# Altium project Dual_Power.PrjPcb
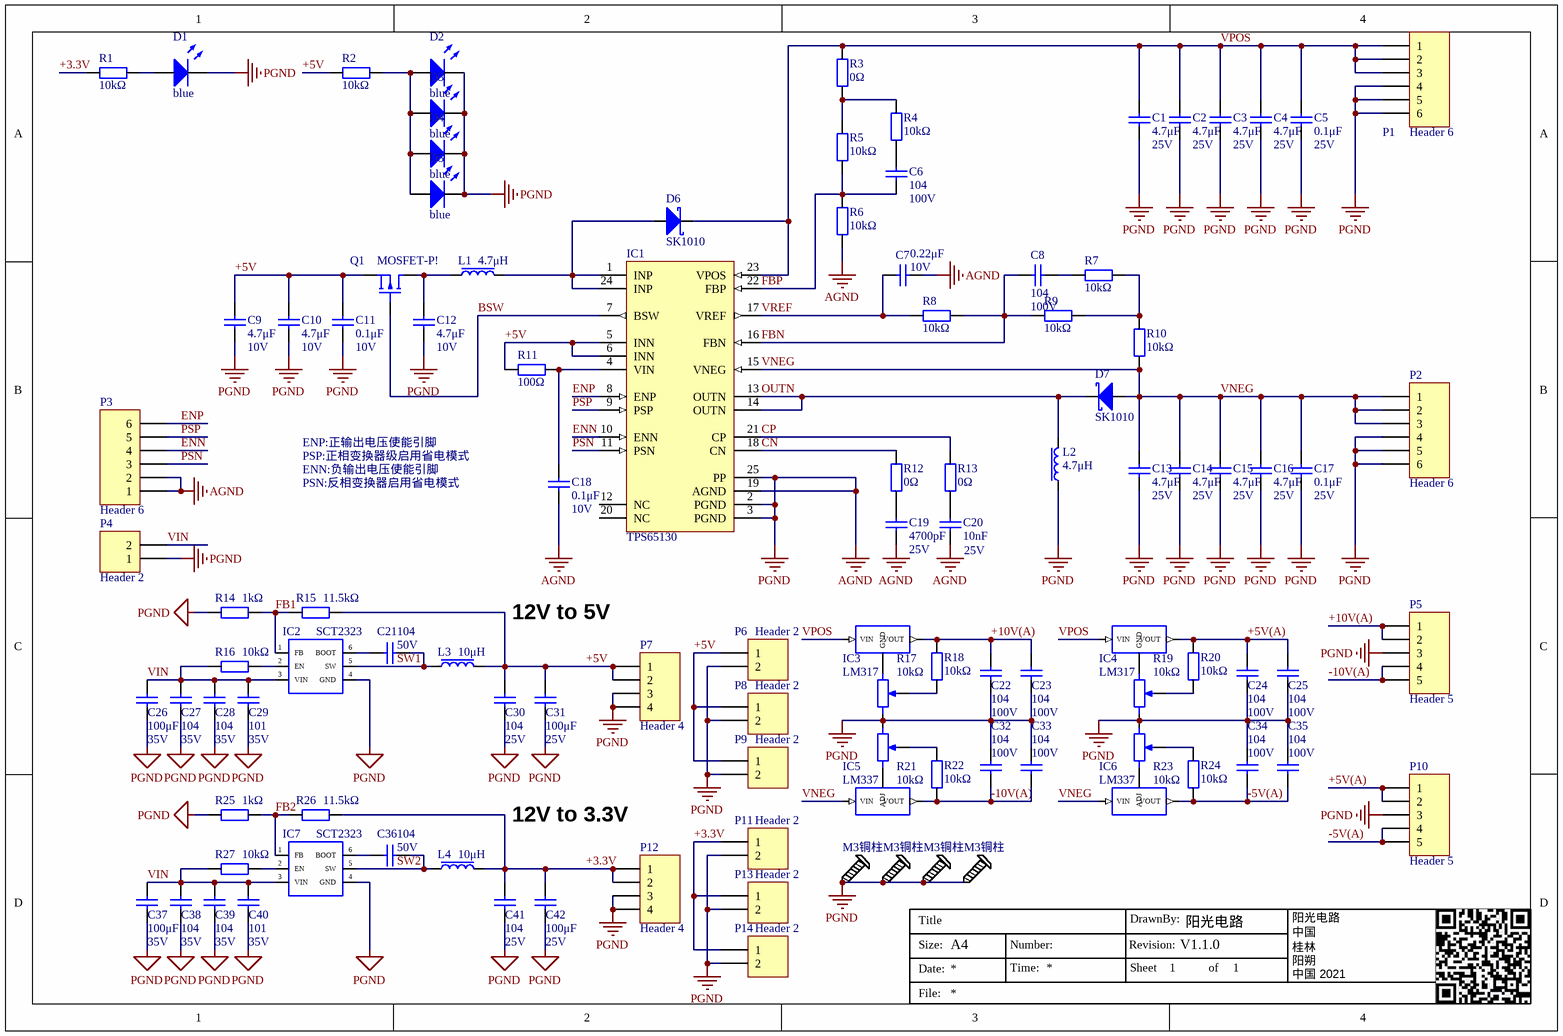
[diagram p0: Dual_Power.SchDoc]
1 sheet, 106 parts. Net scope: global (net labels, ports and power ports of the same name join across sheets).
Board file: Dual_Power.PcbDoc

## Sheet Dual_Power.SchDoc
size A4; DrawnBy: 阳光电路; Organization: 阳光电路; Address1: 中国; Address2: 桂林; Address3: 阳朔; Address4: 中国 2021; Revision: V1.1.0; SheetNumber: 1; SheetTotal: 1

### Parts
C1  capacity: 4.7μF  voltage: 25V  [C0603]  (hidden comment: 叠层陶瓷电容)
C2  capacity: 4.7μF  voltage: 25V  [C0603]  (hidden comment: 叠层陶瓷电容)
C3  capacity: 4.7μF  voltage: 25V  [C0603]  (hidden comment: 叠层陶瓷电容)
C4  capacity: 4.7μF  voltage: 25V  [C0603]  (hidden comment: 叠层陶瓷电容)
C5  capacity: 0.1μF  voltage: 25V  [C0603]  (hidden comment: 叠层陶瓷电容)
C6  voltage: 100V  [C0603]  (hidden comment: 叠层陶瓷电容)
C7  capacity: 0.22μF  voltage: 10V  [C0603]  (hidden comment: 叠层陶瓷电容)
C8  voltage: 100V  [C0603]  (hidden comment: 叠层陶瓷电容)
C9  capacity: 4.7μF  voltage: 10V  [C0603]  (hidden comment: 叠层陶瓷电容)
C10  capacity: 4.7μF  voltage: 10V  [C0603]  (hidden comment: 叠层陶瓷电容)
C11  capacity: 0.1μF  voltage: 10V  [C0603]  (hidden comment: 叠层陶瓷电容)
C12  capacity: 4.7μF  voltage: 10V  [C0603]  (hidden comment: 叠层陶瓷电容)
C13  capacity: 4.7μF  voltage: 25V  [C0603]  (hidden comment: 叠层陶瓷电容)
C14  capacity: 4.7μF  voltage: 25V  [C0603]  (hidden comment: 叠层陶瓷电容)
C15  capacity: 4.7μF  voltage: 25V  [C0603]  (hidden comment: 叠层陶瓷电容)
C16  capacity: 4.7μF  voltage: 25V  [C0603]  (hidden comment: 叠层陶瓷电容)
C17  capacity: 0.1μF  voltage: 25V  [C0603]  (hidden comment: 叠层陶瓷电容)
C18  capacity: 0.1μF  voltage: 10V  [C0603]  (hidden comment: 叠层陶瓷电容)
C19  capacity: 4700pF  voltage: 25V  [C0603]  (hidden comment: 叠层陶瓷电容)
C20  capacity: 10nF  voltage: 25V  [C0603]  (hidden comment: 叠层陶瓷电容)
C21  voltage: 50V  [C0603]  (hidden comment: 叠层陶瓷电容)
C22  voltage: 100V  [C0603]  (hidden comment: 叠层陶瓷电容)
C23  voltage: 100V  [C0603]  (hidden comment: 叠层陶瓷电容)
C24  voltage: 100V  [C0603]  (hidden comment: 叠层陶瓷电容)
C25  voltage: 100V  [C0603]  (hidden comment: 叠层陶瓷电容)
C26  capacity: 100μF  voltage: 35V  [C0603]  (hidden comment: 叠层陶瓷电容)
C27  voltage: 35V  [C0603]  (hidden comment: 叠层陶瓷电容)
C28  voltage: 35V  [C0603]  (hidden comment: 叠层陶瓷电容)
C29  capacity: 101  voltage: 35V  [C0603]  (hidden comment: 叠层陶瓷电容)
C30  voltage: 25V  [C0603]  (hidden comment: 叠层陶瓷电容)
C31  capacity: 100μF  voltage: 25V  [C0603]  (hidden comment: 叠层陶瓷电容)
C32  voltage: 100V  [C0603]  (hidden comment: 叠层陶瓷电容)
C33  voltage: 100V  [C0603]  (hidden comment: 叠层陶瓷电容)
C34  voltage: 100V  [C0603]  (hidden comment: 叠层陶瓷电容)
C35  voltage: 100V  [C0603]  (hidden comment: 叠层陶瓷电容)
C36  voltage: 50V  [C0603]  (hidden comment: 叠层陶瓷电容)
C37  capacity: 100μF  voltage: 35V  [C0603]  (hidden comment: 叠层陶瓷电容)
C38  voltage: 35V  [C0603]  (hidden comment: 叠层陶瓷电容)
C39  voltage: 35V  [C0603]  (hidden comment: 叠层陶瓷电容)
C40  capacity: 101  voltage: 35V  [C0603]  (hidden comment: 叠层陶瓷电容)
C41  voltage: 25V  [C0603]  (hidden comment: 叠层陶瓷电容)
C42  capacity: 100μF  voltage: 25V  [C0603]  (hidden comment: 叠层陶瓷电容)
D1  type: blue  [LED 0603]  (hidden comment: LED)
D2  type: blue  [LED 0603(反贴)]  (hidden comment: LED)
D3  type: blue  [LED 0603(反贴)]  (hidden comment: LED)
D4  type: blue  [LED 0603(反贴)]  (hidden comment: LED)
D5  type: blue  [LED 0603(反贴)]  (hidden comment: LED)
D6  SK1010  [SOD-523]
D7  SK1010  [SOD-523]
IC1  TPS65130  [VQFN-24]
IC2  type: SCT2323  [TSOT-23-6]  (hidden comment: DC-DC)
IC3  LM317  [SOT-223]
IC4  LM317  [SOT-223]
IC5  LM337  [SOT-223]
IC6  LM337  [SOT-223]
IC7  type: SCT2323  [TSOT-23-6]  (hidden comment: DC-DC)
L1  type: 4.7μH  [L0420]  (hidden comment: 电感)
L2  type: 4.7μH  [L0420]  (hidden comment: 电感)
L3  type: 10μH  [L0420]  (hidden comment: 电感)
L4  type: 10μH  [L0420]  (hidden comment: 电感)
P1  Header 6  [HDR1X6]
P2  Header 6  [HDR1X6]
P3  Header 6  [HDR1X6]
P4  Header 2  [XT30PW-M(母)]
P5  Header 5  [HDR1X5]
P6  Header 2  [XH2.54-2P]
P7  Header 4  [HDR1X4]
P8  Header 2  [XH2.54-2P]
P9  Header 2  [XH2.54-2P]
P10  Header 5  [HDR1X5]
P11  Header 2  [XH2.54-2P]
P12  Header 4  [HDR1X4]
P13  Header 2  [XH2.54-2P]
P14  Header 2  [XH2.54-2P]
Q1  MOSFET-P!  [SOT-23]
R1  贴片电阻  [R0603]  (value not drawn)
R2  贴片电阻  [R0603]  (value not drawn)
R3  resistance: 0Ω  [R0603]  (hidden comment: 贴片电阻)
R4  贴片电阻  [R0603]  (value not drawn)
R5  贴片电阻  [R0603]  (value not drawn)
R6  贴片电阻  [R0603]  (value not drawn)
R7  贴片电阻  [R0603]  (value not drawn)
R8  贴片电阻  [R0603]  (value not drawn)
R9  贴片电阻  [R0603]  (value not drawn)
R10  贴片电阻  [R0603]  (value not drawn)
R11  resistance: 100Ω  [R0603]  (hidden comment: 贴片电阻)
R12  resistance: 0Ω  [R0603]  (hidden comment: 贴片电阻)
R13  resistance: 0Ω  [R0603]  (hidden comment: 贴片电阻)
R14  resistance: 1kΩ  [R0603]  (hidden comment: 贴片电阻)
R15  resistance: 11.5kΩ  [R0603]  (hidden comment: 贴片电阻)
R16  贴片电阻  [R0603]  (value not drawn)
R17  10kΩ  [3296W-103]
R18  贴片电阻  [R0603]  (value not drawn)
R19  10kΩ  [3296W-103]
R20  贴片电阻  [R0603]  (value not drawn)
R21  10kΩ  [3296W-103]
R22  贴片电阻  [R0603]  (value not drawn)
R23  10kΩ  [3296W-103]
R24  贴片电阻  [R0603]  (value not drawn)
R25  resistance: 1kΩ  [R0603]  (hidden comment: 贴片电阻)
R26  resistance: 11.5kΩ  [R0603]  (hidden comment: 贴片电阻)
R27  贴片电阻  [R0603]  (value not drawn)
S1  M3铜柱  [M3]
S2  M3铜柱  [M3]
S3  M3铜柱  [M3]
S4  M3铜柱  [M3]

### Nets
AGND: C1.1 C2.1 C3.1 C4.1 C5.1 C7.2 C9.1 C10.1 C11.1 C12.1 C13.1 C14.1 C15.1 C16.1 C17.1 C18.1 C19.1 C20.1 C22.1 C23.1 C24.1 C25.1 C26.1 C27.1 C28.1 C29.1 C30.1 C31.1 C32.2 C33.2 C34.2 C35.2 C37.1 C38.1 C39.1 C40.1 C41.1 C42.1 D1.2(K) D2.2(K) D3.2(K) D4.2(K) D5.2(K) IC1.2(PGND) IC1.3(PGND) IC1.19(AGND) IC1.25(PP) IC2.4(GND) IC7.4(GND) L2.2 P1.4 P1.5 P1.6 P2.4 P2.5 P2.6 P3.1 P3.2 P4.1 P5.3 P6.2 P7.3 P7.4 P8.2 P9.2 P10.3 P11.2 P12.3 P12.4 P13.2 P14.2 R6.1 R14.1 R17.1 R19.1 R21.3 R23.3 R25.1 S1.1(GND) S2.1(GND) S3.1(GND) S4.1(GND)  [also labelled PGND]
+3.3V: C41.2 C42.2 L4.1 P11.1 P12.1 P12.2 P13.1 P14.1 R1.1 R26.2
+5V: C9.2 C10.2 C11.2 C30.2 C31.2 IC1.5(INN) IC1.6(INN) L3.1 P6.1 P7.1 P7.2 P8.1 P9.1 Q1.3(S) R2.1 R11.1 R15.2
+5V(A): C24.2 C25.2 IC4.2(VOUT) P10.1 P10.2 R20.2
+10V(A): C22.2 C23.2 IC3.2(VOUT) P5.1 P5.2 R18.2
-5V(A): C34.1 C35.1 IC6.3(VOUT) P10.4 P10.5 R24.1
-10V(A): C32.1 C33.1 IC5.3(VOUT) P5.4 P5.5 R22.1
BSW: IC1.7(BSW) Q1.1(G)
CN: IC1.18(CN) R12.2
CP: IC1.21(CP) R13.2
ENN: IC1.10(ENN) P3.4
ENP: IC1.8(ENP) P3.6
FB1: IC2.1(FB) R14.2 R15.1
FB2: IC7.1(FB) R25.2 R26.1
FBN: C8.1 IC1.16(FBN) R8.2 R9.1
FBP: C6.1 IC1.22(FBP) R5.1 R6.2
OUTN: D7.2(K) IC1.13(OUTN) IC1.14(OUTN) L2.1
PSN: IC1.11(PSN) P3.3
PSP: IC1.9(PSP) P3.5
SW1: C21.2 IC2.5(SW) L3.2
SW2: C36.2 IC7.5(SW) L4.2
VIN: C26.2 C27.2 C28.2 C29.2 C37.2 C38.2 C39.2 C40.2 IC2.3(VIN) IC7.3(VIN) P4.2 R16.1 R27.1
VNEG: C13.2 C14.2 C15.2 C16.2 C17.2 D7.1(A) IC1.15(VNEG) IC5.2(VIN) IC6.2(VIN) P2.1 P2.2 P2.3 R10.1
VPOS: C1.2 C2.2 C3.2 C4.2 C5.2 D6.2(K) IC1.23(VPOS) IC3.3(VIN) IC4.3(VIN) P1.1 P1.2 P1.3 R3.2
VREF: C7.1 IC1.17(VREF) R8.1
NetC6_2: C6.2 R4.1
NetC8_2: C8.2 R7.1
NetC12_2: C12.2 L1.2 Q1.2(D)
NetC18_2: C18.2 IC1.4(VIN) R11.2
NetC19_2: C19.2 R12.1
NetC20_2: C20.2 R13.1
NetC21_1: C21.1 IC2.6(BOOT)
NetC36_1: C36.1 IC7.6(BOOT)
NetD1_1: D1.1(A) R1.2
NetD2_1: D2.1(A) D3.1(A) D4.1(A) D5.1(A) R2.2
NetD6_1: D6.1(A) IC1.1(INP) IC1.24(INP) L1.1
NetIC2_2: IC2.2(EN) R16.2
NetIC3_1: IC3.1(GND) R17.3
NetIC4_1: IC4.1(GND) R19.3
NetIC5_1: IC5.1(ADJ) R21.1
NetIC6_1: IC6.1(ADJ) R23.1
NetIC7_2: IC7.2(EN) R27.2
NetR3_1: R3.1 R4.2 R5.2
NetR7_2: R7.2 R9.2 R10.2
NetR17_2: R17.2 R18.1
NetR19_2: R19.2 R20.1
NetR21_2: R21.2 R22.2
NetR23_2: R23.2 R24.2

Not connected (* = marked no-connect by the designer): IC1 12(NC) 20(NC)

### Notes on the sheet
- ENP:正输出电压使能引脚
- PSP:正相变换器级启用省电模式
- ENN:负输出电压使能引脚
- PSN:反相变换器启用省电模式
- 12V to 5V
- 12V to 3.3V
- Title
- DrawnBy:
- Size:
- Date:
- A4
- Number:
- Time:
- Revision:
- Sheet
- of
- File:

### Library data of the parts
C1-C42 = 104: 无极性电容; package: 0603
  C6 C8 C21-C25 C27 C28 C30 C32-C36 C38 C39 C41: capacity: 104
D6 D7 = schottky(肖特基二极管): 肖特基二极管; package: SOD-523
IC1 = TPS65130: boost双电源输出; package: VQFN-24; type: TPS65130
IC2 IC7 = SCT2320: 3.8V-32V 2A 同步降压DC-DC变换器; package: SOT-23-6pin
IC3 IC4 = LM317: 线性稳压; package: SOT-223; type: LM317
IC5 IC6 = LM337: 负线性稳压; package: SOT-223; type: LM337
L1-L4 = 470mH
  L1 L2: package: 0402
  L3 L4: package: 0630
P1-P3 = Header 6: Header, 6-Pin; package: 6p排针
P4 P6 P8 P9 P11 P13 P14 = Header 2: Header, 2-Pin
  P4: package: XT30
  P6 P8 P9 P11 P13 P14: LatestRevisionDate: 17-Jul-2002; LatestRevisionNote: Re-released for DXP Platform.; Publisher: Altium Limited
P5 P10 = Header 5: Header, 5-Pin; package: 5p排针
P7 P12 = Header 4: Header, 4-Pin; package: 4p排针
Q1 = MOSFET-P!: 场效应管; type: PMOSFET; package: SOT-23
R1-R16 R18 R20 R22 R24-R27 = 10kΩ: 贴片/直插电阻
  R1 R2: package: 0805; resistance: 10kΩ
  R3 R11-R15 R25 R26: package: 0603
  R4-R10 R16 R18 R20 R22 R24 R27: package: 0603; resistance: 10kΩ
R17 R19 R21 R23 = 100kΩ: 三脚可调式电位器; package: 3296W; resistance: 10KΩ
D1-D5 = LED: package: 0603